# Altium schematic sheet My4G.SchDoc
size A3; SheetNumber: 2; SheetTotal: 5
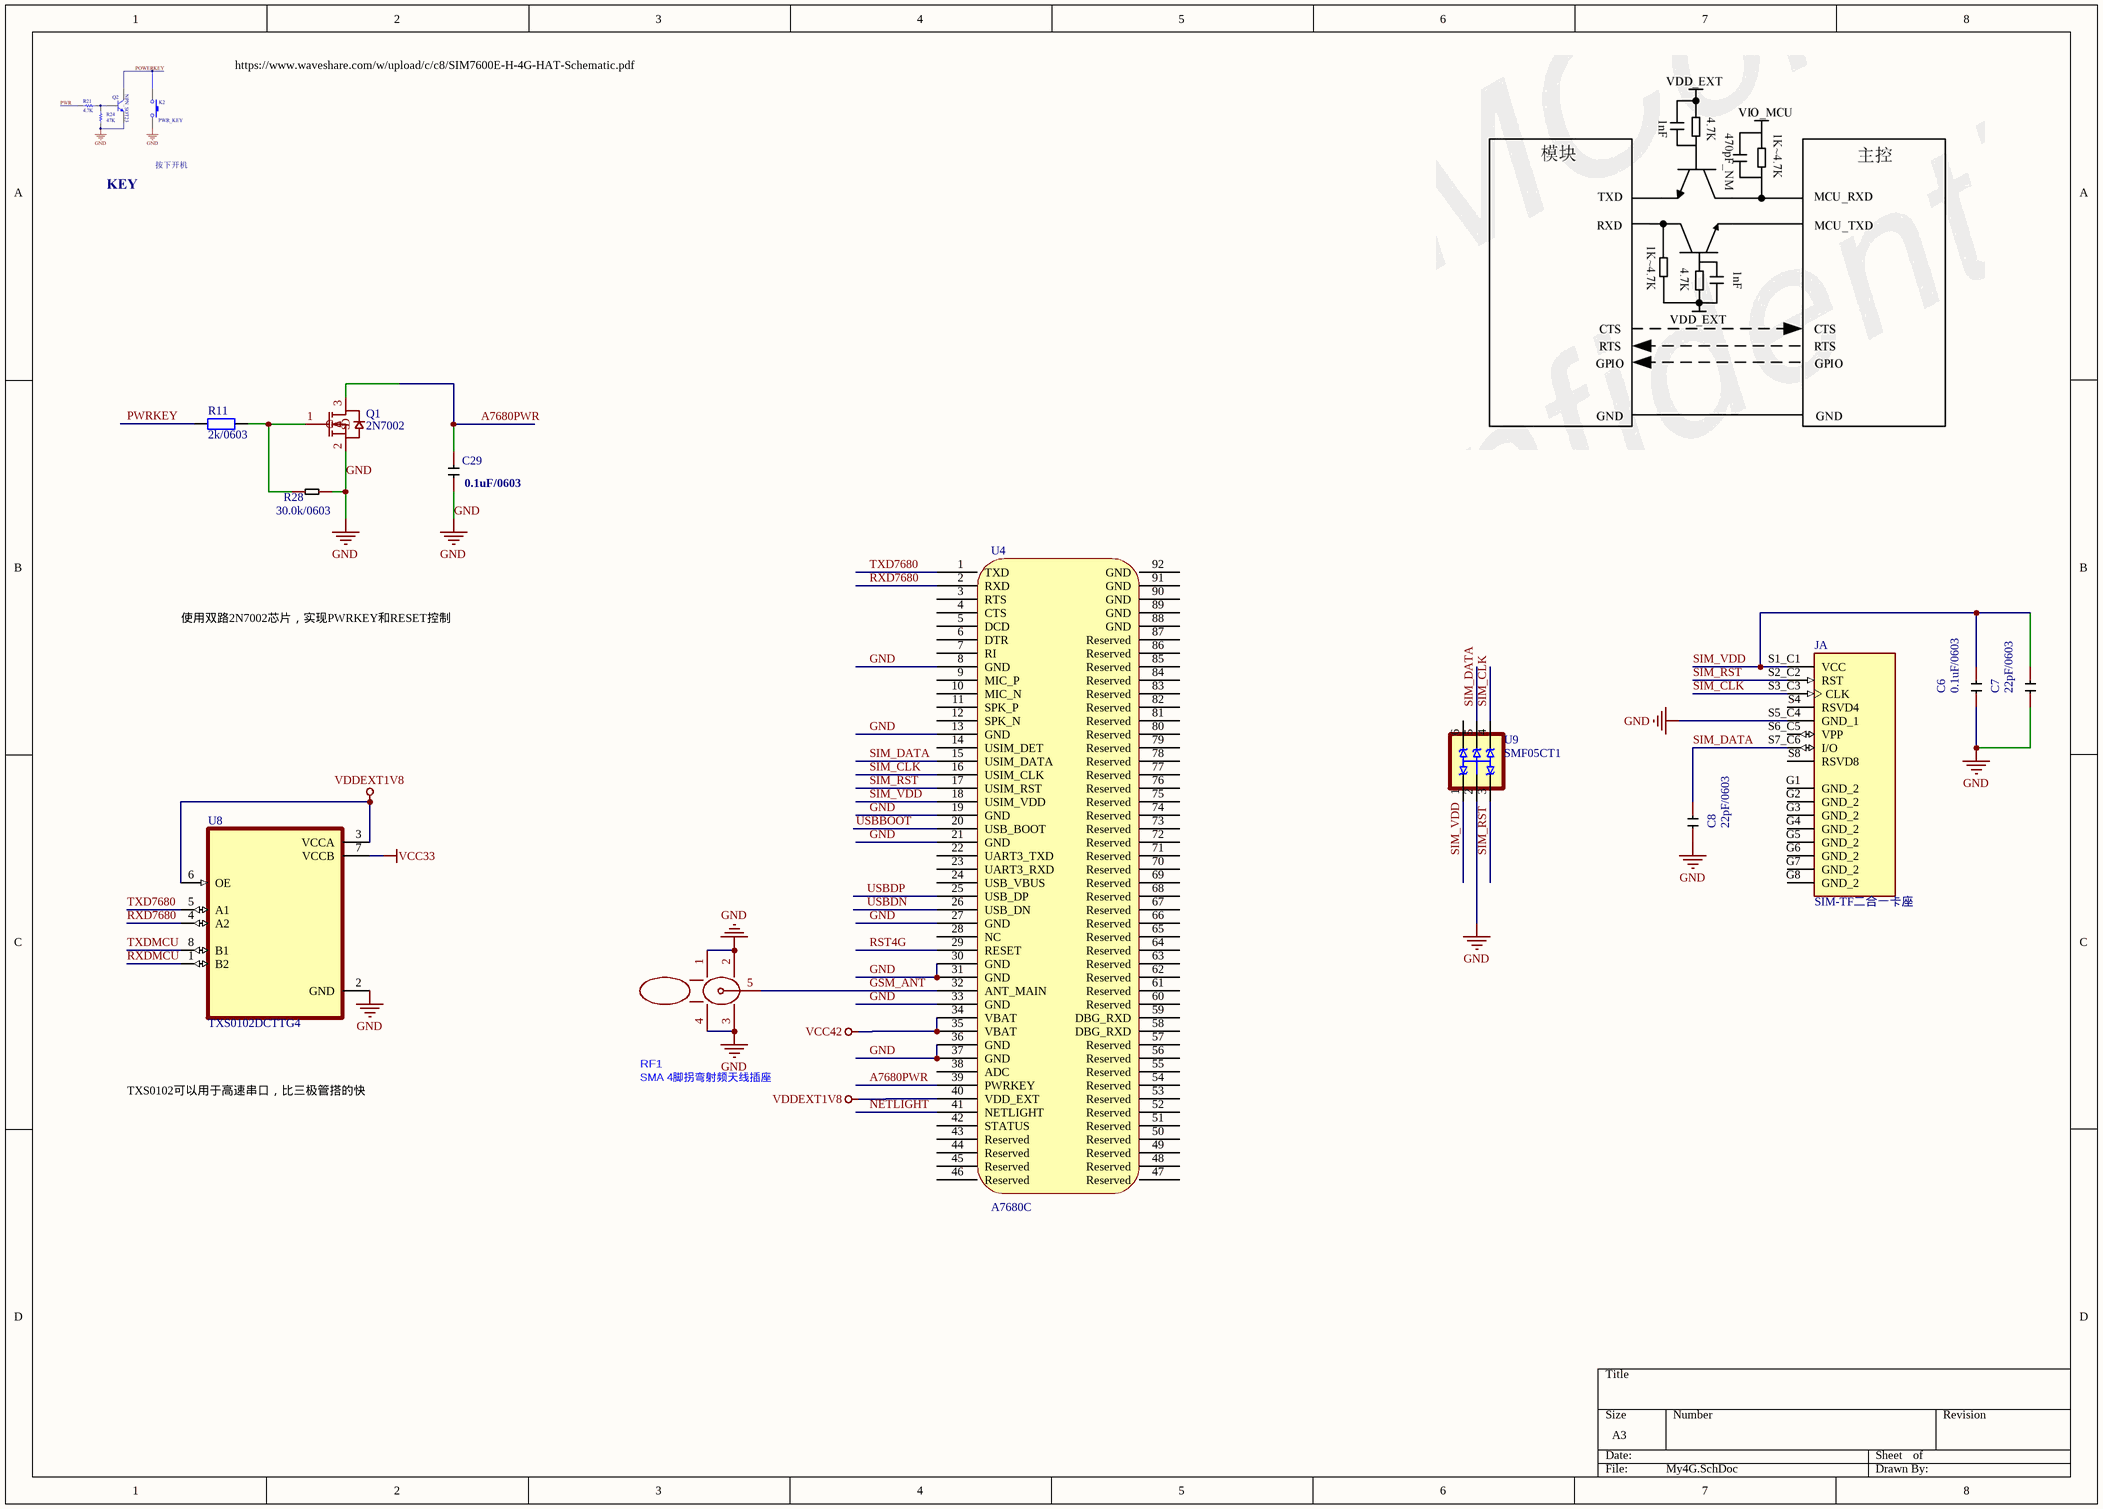
[diagram p0: My4G.SchDoc]

## Parts
C6  0.1uF/0603  [CAP0603]
C7  22pF/0603  [CAP0603]
C8  22pF/0603  [CAP0603]
C29  0.1uF/0603  [CAP0603]
J  SIM-TF二合一卡座  [MOLEX_104642-1610]  (part A of 2)
Q1  2N7002  [SOT-23_2N7002]
R11  2k/0603  [RES0603]
R28  30.0k/0603  [RES0603]
RF1  SMA 4脚拐弯射频天线插座  [SMA-TH_BWSMA-KWE-Z001]
U4  A7680C  [LCC-LAG_L17.6-W15.7_A7680C]
U8  TXS0102DCTTG4  [TXS0102]
U9  SMF05CT1  [SMF05C-SC706]

## Nets
GND: C6.1 C7.1 C8.1 C29.1 J.S5_C4(GND_1) Q1.2(S) R28.1 RF1.1 RF1.2 RF1.3 RF1.4 U4.8(GND) U4.13(GND) U4.19(GND) U4.21(GND) U4.27(GND) U4.30(GND) U4.31(GND) U4.33(GND) U4.36(GND) U4.37(GND) U8.2(GND) U9.2(A)
VCC33: U8.7(VCCB)
VCC42: U4.34(VBAT) U4.35(VBAT)
VDDEXT1V8: U4.40(VDD_EXT) U8.3(VCCA) U8.6(OE)
A7680PWR: C29.2 Q1.3(D) U4.39(PWRKEY)
GSM_ANT: RF1.5 U4.32(ANT_MAIN)
NETLIGHT: U4.41(NETLIGHT)
PWRKEY: R11.1
RST4G: U4.29(RESET)
RXD7680: U4.2(RXD) U8.4(A2)
RXDMCU: U8.1(B2)
SIM_CLK: J.S3_C3(CLK) U4.16(USIM_CLK) U9.4(C3)
SIM_DATA: C8.2 J.S7_C6(I/O) U4.15(USIM_DATA) U9.5(C4)
SIM_RST: J.S2_C2(RST) U4.17(USIM_RST) U9.3(C2)
SIM_VDD: C6.2 C7.2 J.S1_C1(VCC) U4.18(USIM_VDD) U9.1(C1)
TXD7680: U4.1(TXD) U8.5(A1)
TXDMCU: U8.8(B1)
USBBOOT: U4.20(USB_BOOT)
USBDN: U4.26(USB_DN)
USBDP: U4.25(USB_DP)
NetQ1_1: Q1.1(G) R11.2 R28.2

Not connected (* = marked no-connect by the designer): J G1(GND_2) G2(GND_2) G3(GND_2) G4(GND_2) G5(GND_2) G6(GND_2) G7(GND_2) G8(GND_2) S4(RSVD4) S6_C5(VPP) S8(RSVD8); U4 3(RTS) 4(CTS) 5(DCD) 6(DTR) 7(RI) 9(MIC_P) 10(MIC_N) 11(SPK_P) 12(SPK_N) 14(USIM_DET) 22(UART3_TXD) 23(UART3_RXD) 24(USB_VBUS) 28(NC) 38(ADC) 42(STATUS) 43(Reserved) 44(Reserved) 45(Reserved) 46(Reserved) 47(Reserved) 48(Reserved) 49(Reserved) 50(Reserved) 51(Reserved) 52(Reserved) 53(Reserved) 54(Reserved) 55(Reserved) 56(Reserved) 57(Reserved) 58(DBG_RXD) 59(DBG_RXD) 60(Reserved) 61(Reserved) 62(Reserved) 63(Reserved) 64(Reserved) 65(Reserved) 66(Reserved) 67(Reserved) 68(Reserved) 69(Reserved) 70(Reserved) 71(Reserved) 72(Reserved) 73(Reserved) 74(Reserved) 75(Reserved) 76(Reserved) 77(Reserved) 78(Reserved) 79(Reserved) 80(Reserved) 81(Reserved) 82(Reserved) 83(Reserved) 84(Reserved) 85(Reserved) 86(Reserved) 87(Reserved) 88(GND) 89(GND) 90(GND) 91(GND) 92(GND); U9 6(C5)

## Notes on the sheet
- https://www.waveshare.com/w/upload/c/c8/SIM7600E-H-4G-HAT-Schematic.pdf
- 使用双路2N7002芯片，实现PWRKEY和RESET控制
- TXS0102可以用于高速串口，比三极管搭的快

## Library data of the parts
C6 = Discrete_C*_-0603: Name: 0.1uF; Add into BOM: yes; Origin Footprint: 0603; Symbol: Discrete_C*_-0603; Device: Discrete_C*_-0603; Convert to PCB: yes
C7 = Discrete_C*_-0603: Name: 33pF; Add into BOM: yes; Origin Footprint: 0603; Symbol: Discrete_C*_-0603; Device: Discrete_C*_-0603; Convert to PCB: yes
C8 = Discrete_C*_-0603: Add into BOM: yes; Origin Footprint: 0603; Name: 22pF/0603; Symbol: Discrete_C*_-0603; Device: Discrete_C*_-0603; Convert to PCB: yes
C29 = Discrete_C*_-0603: Name: NC; Add into BOM: yes; Origin Footprint: 0603; Symbol: Discrete_C*_-0603; Device: Discrete_C*_-0603; Convert to PCB: yes
J = 104642-1610: 17 (16 + 1) Position Card Connector Combo - microSDâ„¢, Micro SIM Surface Mount, Right Angle Gold or Gold-Palladium; MF: Molex; Package: None; SnapEDA_Link: https://www.snapeda.com/parts/104642-1610/Molex/view-part/501052/?ref=snap; Mouser-Purchase-URL: https://snapeda.com/shop?store=Mouser&id=501052; MP: 104642-1610; Price: None; Availability: Warning; Value: *
Q1 = 2N7002: Nmos 2N7000, 2N7002, NDS7002A
R11 = Res2: Published: 8-Jun-2000; LatestRevisionDate: 17-Jul-2002; LatestRevisionNote: Re-released for DXP Platform.; PackageReference: AXIAL-0.4; Publisher: Altium Limited; PackageDescription: Axial Device, Thru-Hole; 2 Leads; 0.4 in Pin Spacing
R28 = Discrete_R*_-0603: Name: 47K/0603; Add into BOM: yes; Origin Footprint: R0603; Symbol: Discrete_R*_-0603; Device: Discrete_R*_-0603; Convert to PCB: yes
RF1 = BWSMA-KWE-Z001
U4 = A7680C-LAAS: 4G cat1 module
U8 = TXS0102DCTTG4: 2-Bit Bidirectional Voltage-Level Shifter for Open-Drain and Push-Pull Application 8-SM8 -40 to 85; MF: Texas Instruments; SnapEDA_Link: https://www.snapeda.com/parts/TXS0102DCTTG4/Texas+Instruments/view-part/?ref=snap; Package: SSOP-8 Texas Instruments; Value: *; MP: TXS0102DCTTG4; Check_prices: https://www.snapeda.com/parts/TXS0102DCTTG4/Texas+Instruments/view-part/?ref=eda
U9 = SMF05CT1: 12.5V Clamp 8A (8/20Âµs) Ipp Tvs Diode Surface Mount SC-88/SC70-6/SOT-363; MF: ON Semiconductor; Availability: In Stock; Package: SOT-363 ON Semiconductor; MP: SMF05CT1; Value: *; SnapEDA_Link: https://www.snapeda.com/parts/SMF05CT1/Onsemi/view-part/?ref=snap; Price: None; Purchase-URL: https://pricing.snapeda.com/search/part/SMF05CT1/?ref=eda; Check_prices: https://www.snapeda.com/parts/SMF05CT1/Onsemi/view-part/?ref=eda